# EAGLE schematic RX (EAGLE 7.1.0)
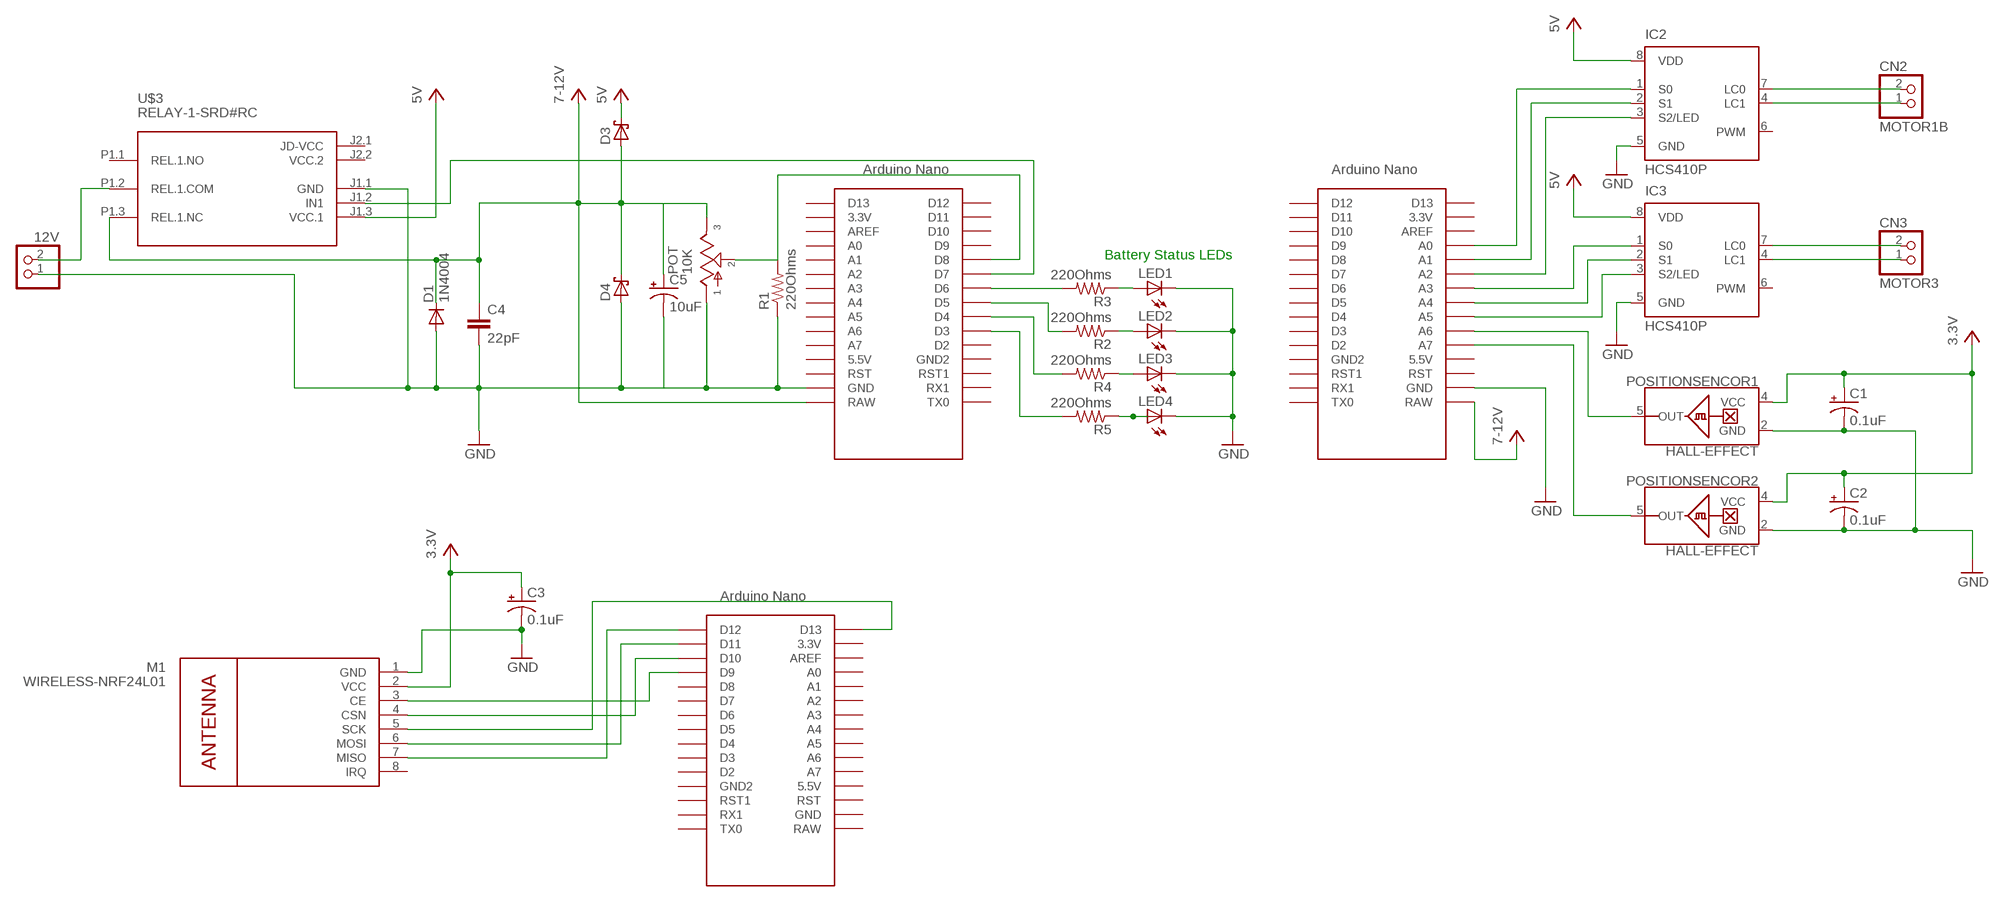
[diagram p0: schematic, sheet 1]

## Parts
12V  JST_2PIN-SMT  [JST-PH-2-SMT]
C1  0.1uF  CAP_POL1206  [EIA3216]
C2  0.1uF  CAP_POL1206  [EIA3216]
C3  0.1uF  CAP_POL1206  [EIA3216]
C4  22pF  C2,5-3  [C2.5-3]
C5  10uF  CAP_POL1206  [EIA3216]
CN2  MOTOR1B  JST_2PIN-SMT  [JST-PH-2-SMT]
CN3  MOTOR3  JST_2PIN-SMT  [JST-PH-2-SMT]
D1  1N4004  [DO41-10]
D3  SCHOTTKY-DIODEAG  [AG]
D4  SCHOTTKY-DIODEAG  [AG]
IC2  HCS410P  [DIL8]
IC3  HCS410P  [DIL8]
LED1  LED  [SMARTLED-TTW]
LED2  LED  [SMARTLED-TTW]
LED3  LED  [SMARTLED-TTW]
LED4  LED  [SMARTLED-TTW]
M1  WIRELESS-NRF24L01  [WIRELESS-NRF24L01]
POSITIONSENCOR1  HALL-EFFECT  [SC70]
POSITIONSENCOR2  HALL-EFFECT  [SC70]
POT  10K  POT  [POT]
R1  220Ohms  R-US_0204/2V  [0204V]
R2  220Ohms  R-US_0204/2V  [0204V]
R3  220Ohms  R-US_0204/2V  [0204V]
R4  220Ohms  R-US_0204/2V  [0204V]
R5  220Ohms  R-US_0204/2V  [0204V]
U$1  NANO  [NANO]
U$2  NANO  [NANO]
U$3  RELAY-1-SRD#RC  [RELAY-1-SRD#RC]
U$4  NANO  [NANO]

## Nets
EXTERNALSUPPLY: 12V.2 U$3.P1.2(REL.1.COM)
GND: 12V.1 C1.C(-) C2.C(-) C3.C(-) C4.2 C5.C(-) D1.A D4.A IC2.5(GND) IC3.5(GND) LED1.C@1(C) LED2.C@1(C) LED3.C@1(C) LED4.C@1(C) M1.1(GND) POSITIONSENCOR1.2(GND) POSITIONSENCOR2.2(GND) POT.1 R1.1 U$1.GND U$2.GND U$3.J1.1(GND)
N$1: CN2.2 IC2.7(LC0)
N$2: CN2.1 IC2.4(LC1)
N$3: CN3.2 IC3.7(LC0)
N$4: CN3.1 IC3.4(LC1)
N$5: IC3.3(S2/LED) U$1.A5
N$6: IC3.2(S1) U$1.A4
N$7: IC3.1(S0) U$1.A3
N$8: IC2.1(S0) U$1.A0
N$9: IC2.2(S1) U$1.A1
N$10: IC2.3(S2/LED) U$1.A2
N$11: U$2.D7 U$3.J1.2(IN1)
N$12: M1.7(MISO) U$4.D12
N$13: M1.6(MOSI) U$4.D11
N$14: M1.4(CSN) U$4.D10
N$15: M1.3(CE) U$4.D9
N$17: LED2.A@1(A) R2.1
N$18: LED1.A@1(A) R3.1
N$19: R3.2 U$2.D6
N$20: POSITIONSENCOR1.5(OUT) U$1.A6
N$21: POSITIONSENCOR2.5(OUT) U$1.A7
N$22: POT.2 R1.2 U$2.D8
N$23: R2.2 U$2.D5
N$24: M1.5(SCK) U$4.D13
N$25: R4.2 U$2.D4
N$26: R5.2 U$2.D3
N$27: LED3.A@1(A) R4.1
N$28: LED4.A@1(A) R5.1
VCC: C1.A(+) C2.A(+) C3.A(+) C4.1 C5.A(+) D1.C D3.A D3.C D4.C IC2.8(VDD) IC3.8(VDD) M1.2(VCC) POSITIONSENCOR1.4(VCC) POSITIONSENCOR2.4(VCC) POT.3 U$1.RAW U$2.RAW U$3.J1.3(VCC.1) U$3.P1.3(REL.1.NC) ; supply symbol labelled 5V, 7-12V, 3.3V
Unconnected: IC2.6(PWM) IC3.6(PWM) M1.8(IRQ) U$1.3.3V U$1.5V(5.5V) U$1.AREF U$1.D2 U$1.D3 U$1.D4 U$1.D5 U$1.D6 U$1.D7 U$1.D8 U$1.D9 U$1.D10 U$1.D11 U$1.D12 U$1.D13 U$1.GND1(GND2) U$1.ICSP1 U$1.ICSP2 U$1.ICSP3 U$1.ICSP4 U$1.ICSP5 U$1.ICSP6 U$1.RST U$1.RST1 U$1.RX1 U$1.TX0 U$2.3.3V U$2.5V(5.5V) U$2.A0 U$2.A1 U$2.A2 U$2.A3 U$2.A4 U$2.A5 U$2.A6 U$2.A7 U$2.AREF U$2.D2 U$2.D9 U$2.D10 U$2.D11 U$2.D12 U$2.D13 U$2.GND1(GND2) U$2.ICSP1 U$2.ICSP2 U$2.ICSP3 U$2.ICSP4 U$2.ICSP5 U$2.ICSP6 U$2.RST U$2.RST1 U$2.RX1 U$2.TX0 U$3.J2.1(JD-VCC) U$3.P1.1(REL.1.NO) U$4.3.3V U$4.5V(5.5V) U$4.A0 U$4.A1 U$4.A2 U$4.A3 U$4.A4 U$4.A5 U$4.A6 U$4.A7 U$4.AREF U$4.D2 U$4.D3 U$4.D4 U$4.D5 U$4.D6 U$4.D7 U$4.D8 U$4.GND U$4.GND1(GND2) U$4.ICSP1 U$4.ICSP2 U$4.ICSP3 U$4.ICSP4 U$4.ICSP5 U$4.ICSP6 U$4.RAW U$4.RST U$4.RST1 U$4.RX1 U$4.TX0

## Notes on the sheet
- Battery Status LEDs

## Power pins joined to a net without a drawn wire
VCC.2: U$3.J2.2(VCC.2)

## Library data of the parts
12V CN2 CN3 = adafruit:JST_2PIN: JST 2-Pin Connectors of various flavors SMT-RA (S2B-PH-SM4) 4UConnector #17311 SMT (B2B-PH-SM4) THM-RA (S2B-PH) THM (B2B-PH)
C1-C3 C5 = SparkFun-Capacitors:CAP_POL: Capacitor Polarized These are standard SMD and PTH capacitors. Normally 10uF, 47uF, and 100uF in electrolytic and tantalum varieties. Always verify the external diameter of the through hole cap, it varies with capacity, voltage, and manufacturer. The EIA devices should be standard.
C4 = capacitor-wima:C: CAPACITOR naming: grid - package width
D1 = adafruit:1N4004: DIODE General purpose 1N400x type rectifier (With bigger pads) http://www.ladyada.net/library/pcb/eaglelibrary.html
D3 D4 = adafruit:SCHOTTKY-DIODE: Schottky Diode
IC2 IC3 = microchip:HCS410: ENCODER code hopping encoder and transponder; MF: MICROCHIP; MPN: HCS410-I/P; OC_FARNELL: unknown; OC_NEWARK: 96K3679
LED1-LED4 = adafruit:LED: LED OSRAM: - CHIPLED LG R971, LG N971, LY N971, LG Q971, LY Q971, LO R971, LY R971 LH N974, LH R974 LS Q976, LO Q976, LY Q976 LO Q996 - Hyper CHIPLED LW Q18S LB Q993, LB Q99A, LB R99A - SideLED LS A670, LO A670, LY A670, LG A670, LP A670 LB A673, LV A673, LT A673, LW A673 LH A674 LY A675 LS A676, LA A676, LO A676, LY A676, LW A676 LS A679, LY A679, LG A679 - Hyper Micro SIDELED® LS Y876, LA Y876, LO Y876, LY Y876 LT Y87S - SmartLED LW L88C, LW L88S LB L89C, LB L89S, LG L890 LS L89K, LO L89K, LY L89K LS L896, LA L896, LO L896, LY L896 - TOPLED LS T670, LO T670, LY T670, LG T670, LP T670 LSG T670, LSP T670, LSY T670, LOP T670, LYG T670 LG T671, LOG T671, LSG T671 LB T673, LV T673, LT T673, LW T673 LH T674 LS T676, LA T676, LO T676, LY T676, LB T676, LH T676, LSB T676, LW T676 LB T67C, LV T67C, LT T67C, LS T67K, LO T67K, LY T67K, LW E67C LS E67B, LA E67B, LO E67B, LY E67B, LB E67C, LV E67C, LT E67C LW T67C LS T679, LY T679, LG T679 LS T770, LO T770, LY T770, LG T770, LP T770 LB T773, LV T773, LT T773, LW T773 LH T774 LS E675, LA E675, LY E675, LS T675 LS T776, LA T776, LO T776, LY T776, LB T776 LHGB T686 LT T68C, LB T68C - Hyper Mini TOPLED® LB M676 - Mini TOPLED Santana® LG M470 LS M47K, LO M47K, LY M47K Source: http://www.osram.convergy.de/
M1 = diy-modules:WIRELESS-NRF24L01: 2.4 GHz Wireless Module based on NRF24L01 chip More details available here: http://www.electrodragon.com/w/NRF24L01 Click here to find device on ebay.com <http://www.ebay.com/sch/nrf24l01+arduino>
POSITIONSENCOR1 POSITIONSENCOR2 = SparkFun-Sensors:HALL-EFFECT: Panasonic AN4884 Hall Effect Sensor The AN48841B is a Hall IC (a magnetic sensor) for 3.0 V supply voltage built using Bi-CMOS technology. In this Hall IC are a Hall element, an offset cancel circuit, an amplifier circuit, a sample-and-hold circuit, a Schmidt circuit, and an output stage FET are integrated on a single chip housed in a small SC70 package. Datasheet <http://www.semicon.panasonic.co.jp/ds4/AN48841B_E.pdf> SparkFun Products SparkFun Blackberry Trackballer Breakout <https://www.sparkfun.com/products/13169> (COM-13169) - Hall sensor is triggered by tiny magnets on trackball.; PROD_ID: IC-09214
POT = gm-pots:POT: Potentiometers the arrow indicates the clockwise motion of th wiper (lug 2) fully counter clockwise there is no resistance between lugs 1 and 2 fully clockwise the resistance between lugs 1 and 2 is the value of the pot
R1-R5 = adafruit:R-US_: RESISTOR, American symbol
U$1 U$2 U$4 = Arduino-clone:NANO: Arduino Nano
U$3 = diy-modules:RELAY-1-SRD#RC: 1-Channel Relay Module based on SRD-05VDC-SL-C relays Symbol with relays pins Click here to find device on ebay.com <http://www.ebay.com/sch/one+channel+isolated+relay+5v>